# Altium schematic sheet Allegro.SchDoc
size A4
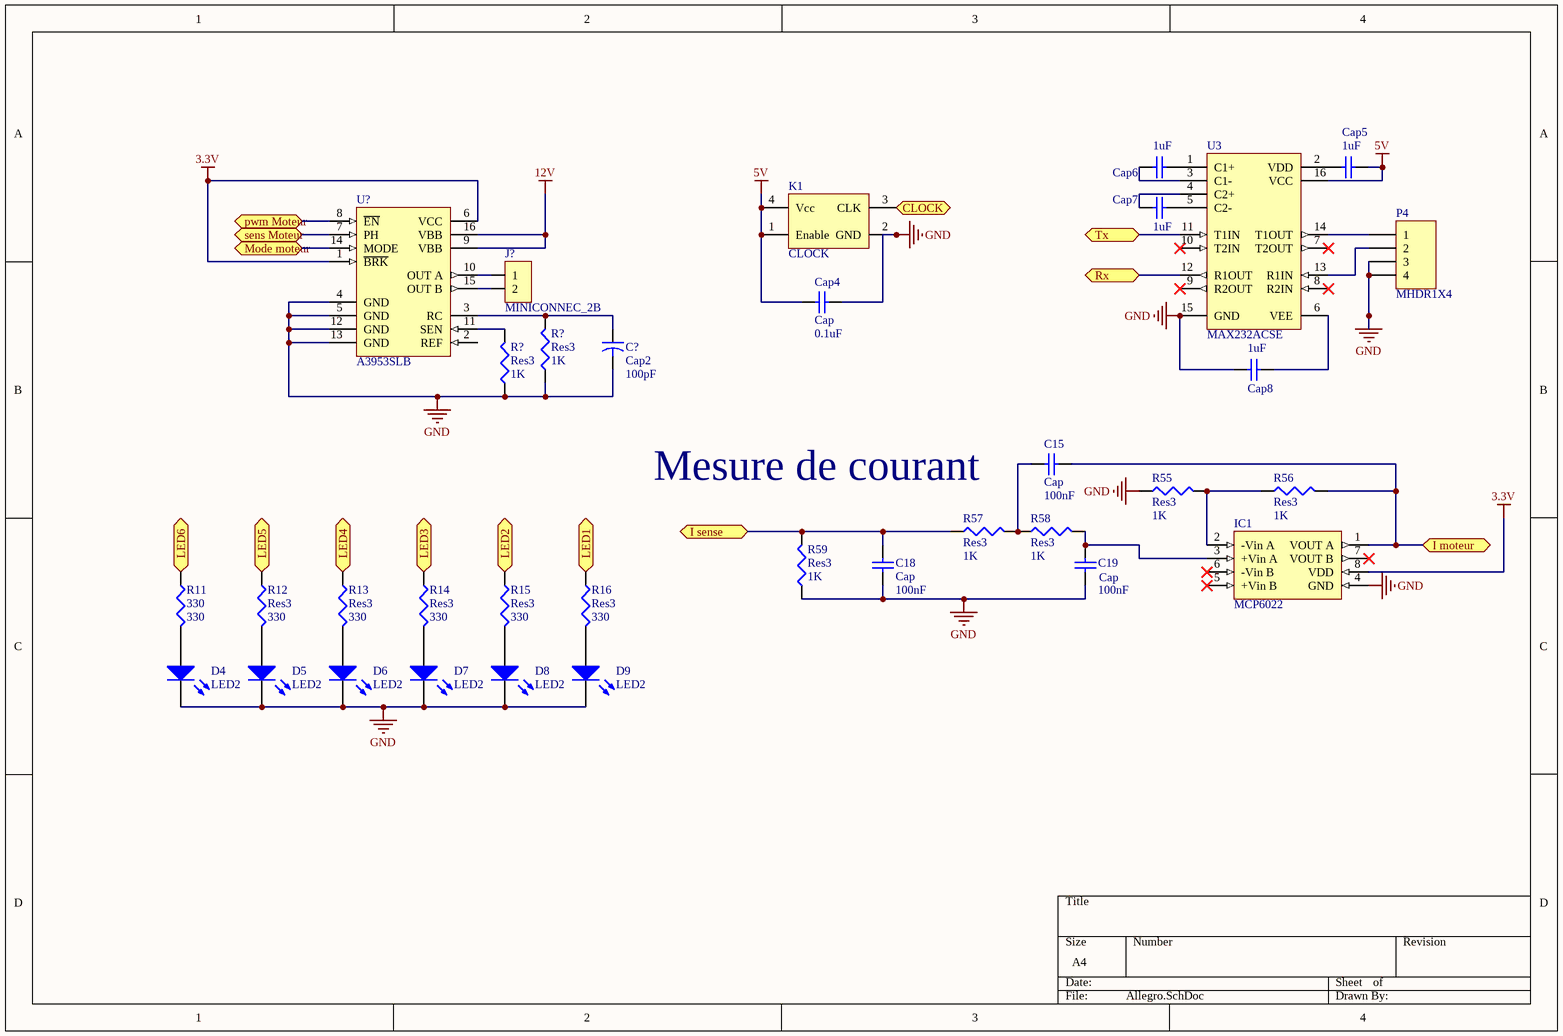
[diagram p0: Allegro.SchDoc]

## Parts
(Parts that share a designator on the sheet are numbered #1, #2 ... from top to bottom, then left to right.)
C15  Cap  value 100nF  [RAD-0.3]
C18  Cap  value 100nF  [RAD-0.3]
C19  Cap  value 100nF  [RAD-0.3]
C?  Cap2  value 100pF  [CAPR5-4X5]
Cap4  Cap  value 0.1uF  [RAD-0.3]
Cap5  1uF  [RAD-0.3]
Cap6  1uF  [RAD-0.3]
Cap7  1uF  [RAD-0.3]
Cap8  1uF  [RAD-0.3]
D4  LED2  [DSO-F2/D6.1]
D5  LED2  [DSO-F2/D6.1]
D6  LED2  [DSO-F2/D6.1]
D7  LED2  [DSO-F2/D6.1]
D8  LED2  [DSO-F2/D6.1]
D9  LED2  [DSO-F2/D6.1]
IC1  MCP6022  [SOIC 4B]
J?  MINICONNEC_2B  [MINICONNEC_C]
K1  CLOCK  [IQXO-70]
P4  MHDR1X4  [MHDR1X4]
R11  330  [RESC1608L]
R12  Res3  value 330  [RESC1608L]
R13  Res3  value 330  [RESC1608L]
R14  Res3  value 330  [RESC1608L]
R15  Res3  value 330  [RESC1608L]
R16  Res3  value 330  [RESC1608L]
R55  Res3  value 1K  [RESC1608L]
R56  Res3  value 1K  [RESC1608L]
R57  Res3  value 1K  [RESC1608L]
R58  Res3  value 1K  [RESC1608L]
R59  Res3  value 1K  [RESC1608L]
R?#1  Res3  value 1K  [RESC1608L]
R?#2  Res3  value 1K  [RESC1608L]
U3  MAX232ACSE  [NSO16_M]
U?  A3953SLB  [LB16_N]

## Ports
CLOCK (bidir), I moteur (bidir), I sense, LED1 (bidir), LED2 (bidir), LED3 (bidir), LED4 (bidir), LED5 (bidir), LED6 (bidir), Mode moteur, pwm Moteur, Rx (bidir), sens Moteur, Tx (bidir)

## Nets
3.3V: IC1.8(VDD) U?.1(~{BRK}) U?.6(VCC)
5V: Cap4.1 Cap5.1 K1.1(Enable) K1.4(Vcc) U3.16(VCC)
12V: U?.9(VBB) U?.16(VBB)
GND: C18.1 C19.1 C?.2 Cap4.2 Cap8.1 D4.2(K) D5.2(K) D6.2(K) D7.2(K) D8.2(K) D9.2(K) IC1.4(GND) K1.2(GND) P4.3 P4.4 R55.1 R59.1 R?#1.1 R?#2.1 U3.15(GND) U?.4(GND) U?.5(GND) U?.12(GND) U?.13(GND)
CLOCK: K1.3(CLK) ; port CLOCK
I moteur: C15.1 IC1.1(VOUT_A) R56.2 ; port I moteur
I sense: C18.2 R57.1 R59.2 ; port I sense
LED1: R16.1 ; port LED1
LED2: R15.1 ; port LED2
LED3: R14.1 ; port LED3
LED4: R13.1 ; port LED4
LED5: R12.1 ; port LED5
LED6: R11.1 ; port LED6
Mode moteur: U?.14(MODE) ; port Mode moteur
pwm Moteur: U?.8(~{EN}) ; port pwm Moteur
Rx: U3.12(R1OUT) ; port Rx
sens Moteur: U?.7(PH) ; port sens Moteur
Tx: U3.11(T1IN) ; port Tx
NetC15_2: C15.2 R57.2 R58.1
NetC19_2: C19.2 IC1.3(+Vin_A) R58.2
NetC?_1: C?.1 R?#1.2 U?.3(RC)
NetCap5_2: Cap5.2 U3.2(VDD)
NetCap6_1: Cap6.1 U3.1(C1+)
NetCap6_2: Cap6.2 U3.3(C1-)
NetCap7_1: Cap7.1 U3.5(C2-)
NetCap7_2: Cap7.2 U3.4(C2+)
NetCap8_2: Cap8.2 U3.6(VEE)
NetD4_1: D4.1(A) R11.2
NetD5_1: D5.1(A) R12.2
NetD6_1: D6.1(A) R13.2
NetD7_1: D7.1(A) R14.2
NetD8_1: D8.1(A) R15.2
NetD9_1: D9.1(A) R16.2
NetIC1_2: IC1.2(-Vin_A) R55.2 R56.1
NetJ?_1: J?.1 U?.10(OUT_A)
NetJ?_2: J?.2 U?.15(OUT_B)
NetP4_1: P4.1 U3.14(T1OUT)
NetP4_2: P4.2 U3.13(R1IN)
NetR?#2_2: R?#2.2 U?.11(SEN)

Not connected (* = marked no-connect by the designer): IC1 5(+Vin_B)* 6(-Vin_B)* 7(VOUT_B)*; U3 7(T2OUT)* 8(R2IN)* 9(R2OUT)* 10(T2IN)*; U? 2(REF)

## Notes on the sheet
- (near C15) Mesure de courant

## Library data of the parts
C15 C18 C19 Cap4-Cap8 = Cap: Capacitor; Published: 8-Jun-2000; LatestRevisionDate: 17-Jul-2002; LatestRevisionNote: Re-released for DXP Platform.; PackageReference: RAD-0.3; Publisher: Altium Limited
C? = Cap2: Capacitor; Published: 23-Sep-2002; PackageReference: CAPR5-4X5; Publisher: Altium Limited
D4-D9 = LED2: Typical RED, GREEN, YELLOW, AMBER GaAs LED; Published: 8-Jun-2000; LatestRevisionDate: 17-Jul-2002; LatestRevisionNote: Re-released for DXP Platform.; PackageVersion: Feb-2002; PackageReference: 3.2X1.6X1.1; Publisher: Altium Limited
IC1 = MCP6022: AOP Microchip
J? = MINICONNEC_2B: Connecteur
K1 = OSCILLATEUR: Oscillateur quartz
P4 = MHDR1X4: Header, 4-Pin; LatestRevisionDate: 17-Jul-2002; LatestRevisionNote: Re-released for DXP Platform.; Publisher: Altium Limited
R11-R16 R55-R59 R?#1 R?#2 = Res3: Resistor; Published: 8-Jun-2000; LatestRevisionDate: 29-May-2009; LatestRevisionNote: IPC-7351 Footprint Added.; PackageReference: J1-0603; Publisher: Altium Limited; PackageDescription: Chip Resistor
  R11: Value: 330
U3 = MAX232ACSE: +5V Powered, Multi-Channel RS-232 Driver/Receiver; Published: 16-Jan-2001; LatestRevisionDate: 13-Apr-2006; LatestRevisionNote: IPC-7351 Footprint Added.; PackageReference: NSO16; Publisher: Altium Limited; PackageDescription: 16-Pin Small Outline Integrated Circuit 1.27 mm Pitch; Code_JEDEC: MS-012-AC; Code_IPC: SOIC127P600-16; ComponentLink1Description: Manufacturer Link; ComponentLink1URL: http://www.maxim-ic.com/; ComponentLink2Description: Datasheet; ComponentLink2URL: http://pdfserv.maxim-ic.com/en/ds/MAX220-MAX249.pdf
U? = A3953SLB: Full-Bridge PWM Motor Driver; Note: Pins (4,5) and (12,13) exist as TABS; all are internally connected (GND).; Published: 13-Oct-2000; LatestRevisionDate: 13-Apr-2006; LatestRevisionNote: IPC-7351 Footprint Added.; DatasheetVersion: 1995; PackageReference: LB16; Publisher: Altium Limited; PackageDescription: 16-Pin Small Outline Integrated Circuit 1.27 mm Pitch; Code_JEDEC: MS-013-AA; Code_IPC: SOIC127P1030-16; ComponentLink1Description: Manufacturer Link; ComponentLink1URL: http://www.allegromicro.com/; ComponentLink2Description: Datasheet; ComponentLink2URL: http://www.allegromicro.com/sf/3953/